# EAGLE design l5973d_mod (EAGLE 6.4)
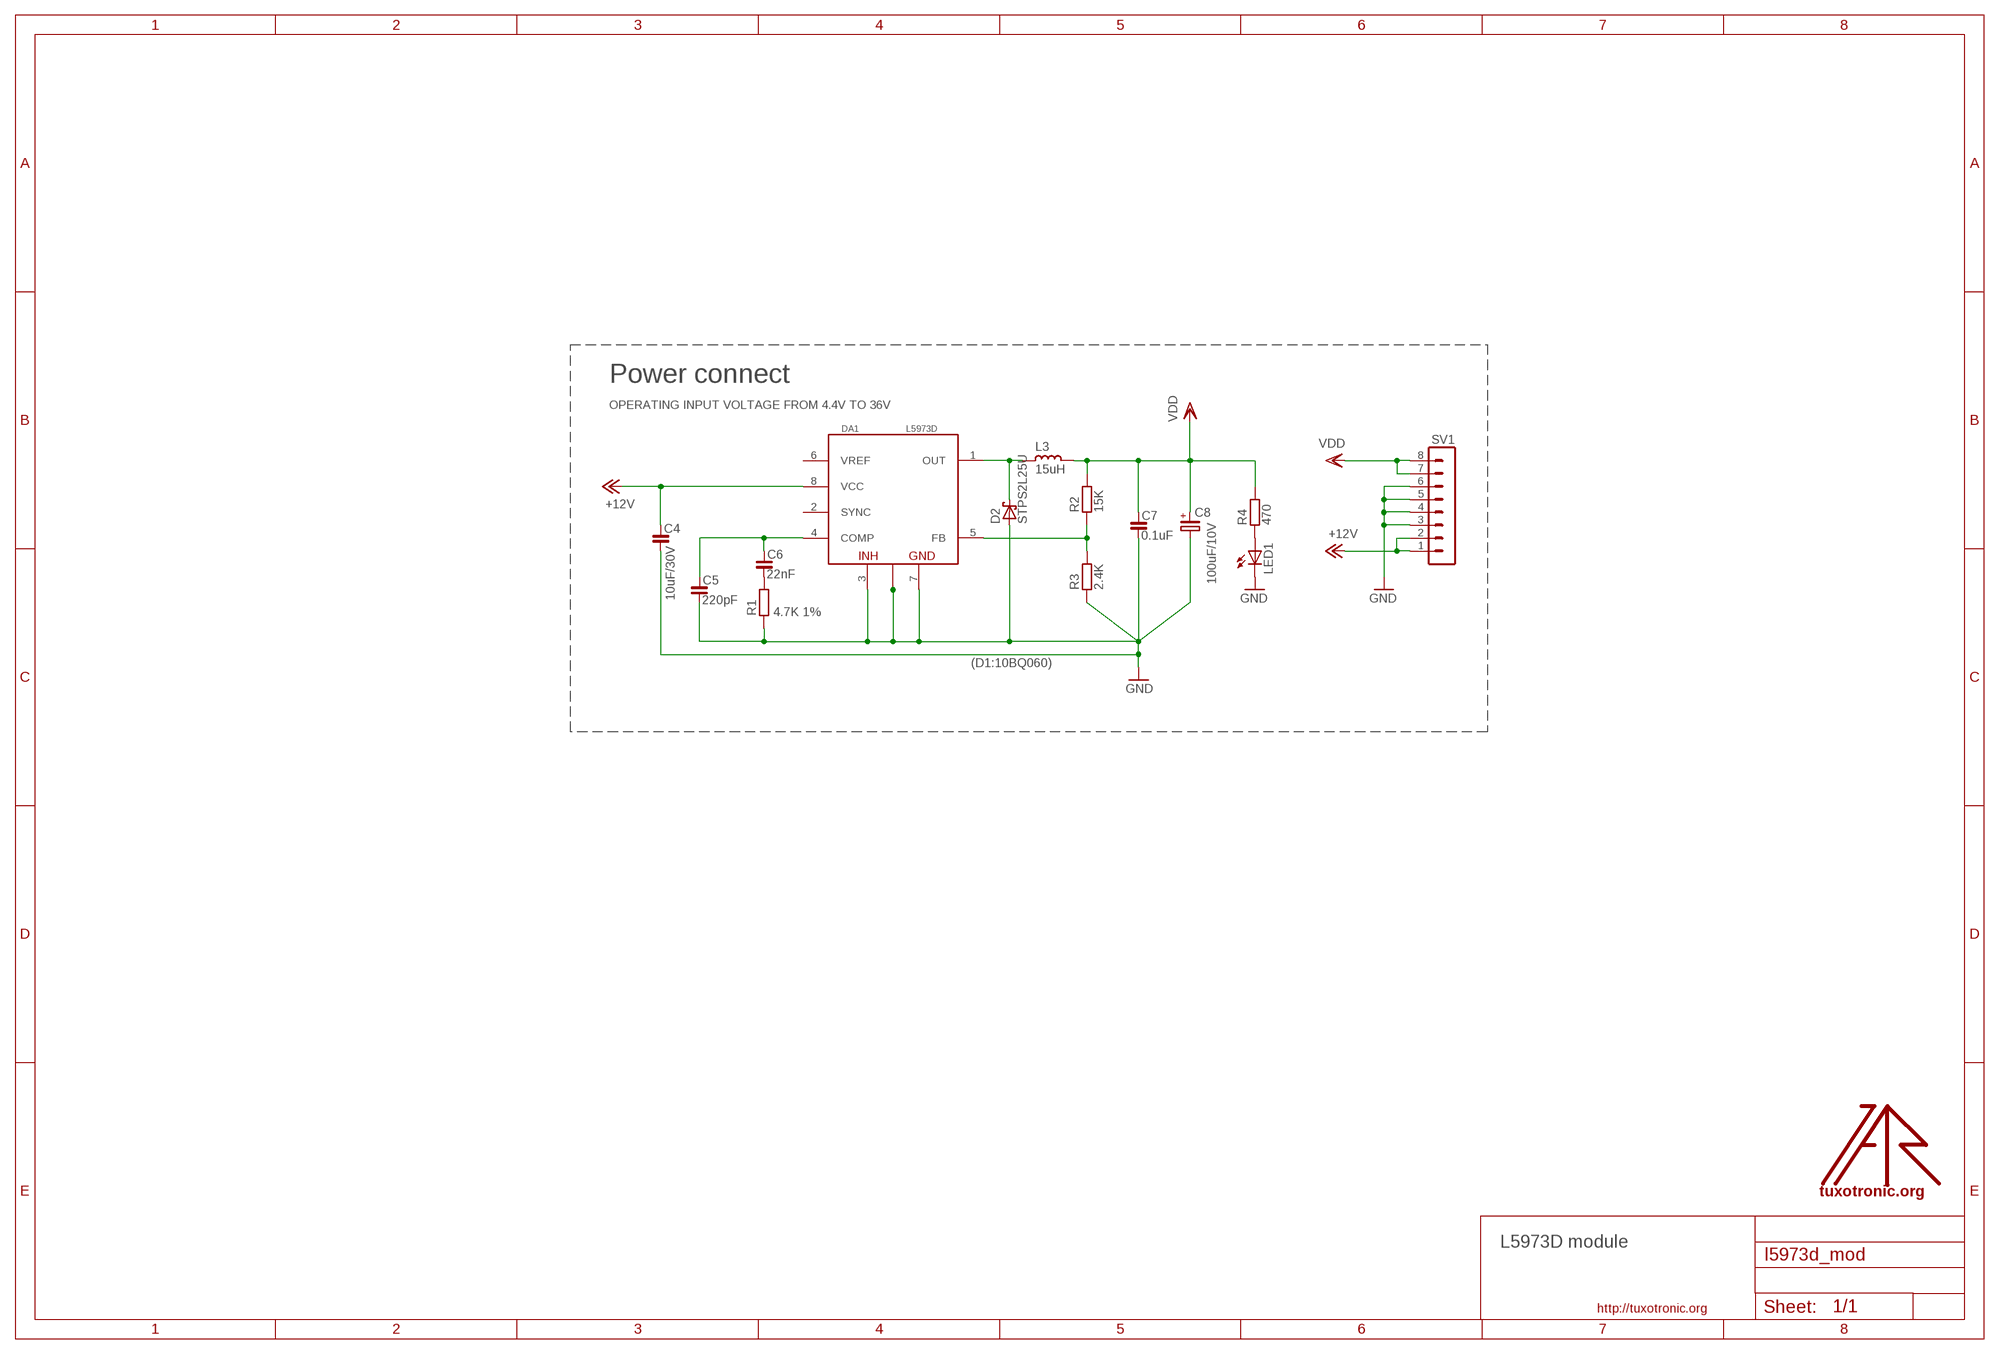
[diagram p0: schematic, sheet 1]

## Parts
C4  10uF/30V  C_1210  [C1210]
C5  220pF  C_0603  [C0603]
C6  22nF  C_0603  [C0603]
C7  0.1uF  C_0805  [C0805]
C8  100uF/10V  CP_E-035X080  [CE-035X080]
D2  STPS2L25U  SCHOTTKY-DIODESMD  [SMB]
DA1  L5973D  [HSOP8-PAD]
L3  15uH  L_CD75  [CD75]
LED1  LEDCHIPLED_0805  [CHIPLED_0805]
R1  4.7K 1%  R_0603  [R0603]
R2  15K  R_0603  [R0603]
R3  2.4K  R_0603  [R0603]
R4  470  R_0603  [R0603]
SV1  MA08-1W  [MA08-1W]
U$1  LOGO  [TT_LOGO]

## Nets
+12V: C4.1 DA1.8(VCC) SV1.1 SV1.2
GND: C4.2 C5.2 C7.2 C8.- D2.A DA1.3(INH) DA1.7(GND) DA1.P(GND) LED1.C R1.1 R3.1 SV1.3 SV1.4 SV1.5 SV1.6
N$29: LED1.A R4.1
N$41: D2.C DA1.1(OUT) L3.2
N$42: DA1.5(FB) R2.1 R3.2
N$43: C6.2 R1.2
N$44: C5.1 C6.1 DA1.4(COMP)
VDD: C7.1 C8.+ L3.1 R2.2 R4.2 SV1.7 SV1.8
Unconnected: DA1.2(SYNC) DA1.6(VREF)

## Notes on the sheet
- Power connect
- OPERATING INPUT VOLTAGE FROM 4.4V TO 36V
- (D1:10BQ060)
- L5973D module

## Library data of the parts
C4-C7 = rc-master-smd:C_: NON-POLARIZED CAP
C8 = rc-master:CP_: POLARIZED CAP
D2 = main:SCHOTTKY-DIODE: Schottky Diode
DA1 = vreg-pulse:L5973: 2A SWITCH STEP DOWN SWITCHING REGULATOR
L3 = rc-master-smd:L_: INDUCTOR
LED1 = led:LED: LED OSRAM: - CHIPLED LG R971, LG N971, LY N971, LG Q971, LY Q971, LO R971, LY R971 LH N974, LH R974 LS Q976, LO Q976, LY Q976 LO Q996 - Hyper CHIPLED LW Q18S LB Q993, LB Q99A, LB R99A - SideLED LS A670, LO A670, LY A670, LG A670, LP A670 LB A673, LV A673, LT A673, LW A673 LH A674 LY A675 LS A676, LA A676, LO A676, LY A676, LW A676 LS A679, LY A679, LG A679 - Hyper Micro SIDELED® LS Y876, LA Y876, LO Y876, LY Y876 LT Y87S - SmartLED LW L88C, LW L88S LB L89C, LB L89S, LG L890 LS L89K, LO L89K, LY L89K LS L896, LA L896, LO L896, LY L896 - TOPLED LS T670, LO T670, LY T670, LG T670, LP T670 LSG T670, LSP T670, LSY T670, LOP T670, LYG T670 LG T671, LOG T671, LSG T671 LB T673, LV T673, LT T673, LW T673 LH T674 LS T676, LA T676, LO T676, LY T676, LB T676, LH T676, LSB T676, LW T676 LB T67C, LV T67C, LT T67C, LS T67K, LO T67K, LY T67K, LW E67C LS E67B, LA E67B, LO E67B, LY E67B, LB E67C, LV E67C, LT E67C LW T67C LS T679, LY T679, LG T679 LS T770, LO T770, LY T770, LG T770, LP T770 LB T773, LV T773, LT T773, LW T773 LH T774 LS E675, LA E675, LY E675, LS T675 LS T776, LA T776, LO T776, LY T776, LB T776 LHGB T686 LT T68C, LB T68C - Hyper Mini TOPLED® LB M676 - Mini TOPLED Santana® LG M470 LS M47K, LO M47K, LY M47K Source: http://www.osram.convergy.de - LUMILED® LXK2-PW12-R00, LXK2-PW12-S00, LXK2-PW14-U00, LXK2-PW14-V00 LXK2-PM12-R00, LXK2-PM12-S00, LXK2-PM14-U00 LXK2-PE12-Q00, LXK2-PE12-R00, LXK2-PE12-S00, LXK2-PE14-T00, LXK2-PE14-U00 LXK2-PB12-K00, LXK2-PB12-L00, LXK2-PB12-M00, LXK2-PB14-N00, LXK2-PB14-P00, LXK2-PB14-Q00 LXK2-PR12-L00, LXK2-PR12-M00, LXK2-PR14-Q00, LXK2-PR14-R00 LXK2-PD12-Q00, LXK2-PD12-R00, LXK2-PD12-S00 LXK2-PH12-R00, LXK2-PH12-S00 LXK2-PL12-P00, LXK2-PL12-Q00, LXK2-PL12-R00 Source: www.luxeon.com
R1-R4 = rc-master-smd:R_: RESISTOR
SV1 = con-lstb:MA08-1W: PIN HEADER
U$1 = logo:LOGO

## Board
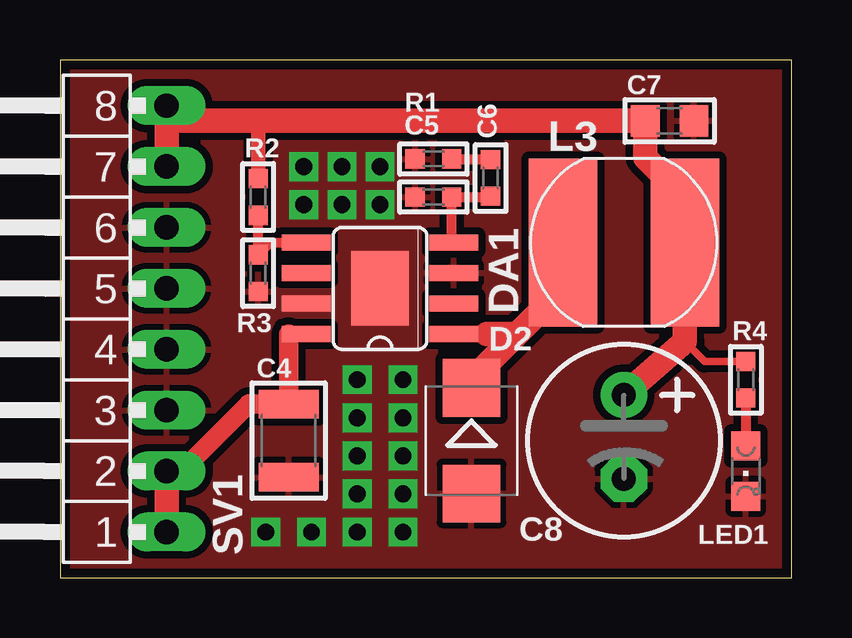
[diagram p1: board, top side]
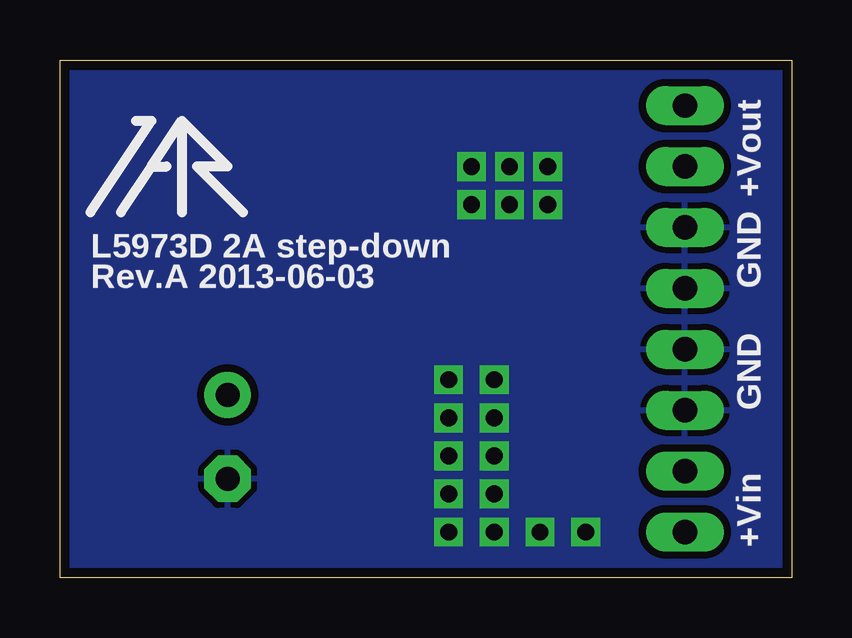
[diagram p2: board, bottom side, seen from below]

Size 30.48 x 21.59 mm. Coordinates in mm from the lower left corner, seen from the top.
Outline: 0,0 30.48,0 30.48,21.59 0,21.59 0,0
Copper layers (1*16): Top 0.018mm / dielectric 1.5011mm / Bottom 0.018mm
Design rules "resonit-speed-18mkm": minimum track width 0.16mm, minimum drill 0.5mm, track to track 0.16mm, track to pad 0.16mm, pad to pad 0.16mm, via to via 0.16mm, smd to smd 0.16mm, copper to edge 0.4mm, drill to drill 8mil, minimum pad ring 0.2489mm, minimum via ring 0.2489mm, stop-mask expansion 4mil, vias tented up to drill 0.5994mm, thermal gap 10mil

### Footprints (pad centres in the part's own frame; a part is rotated, then mirrored left to right if it is on the bottom)
C1210 = smd 1.2 x 2.5: 1 -1.524,0; 2 1.524,0
C0603 = smd 0.8 x 0.8: 1 -0.762,0; 2 0.762,0
C0805 = smd 1.2 x 1.3: 1 -1.016,0; 2 1.016,0
CE-035X080 = drill 1 pad 1.93: + -1.905,0 | drill 1 pad 1.93 octagon: - 1.587,0
SMB = smd 2.4 x 2.4: A 2.2,0; C -2.2,0
HSOP8-PAD = smd 0.66 x 2.032: 1 -1.905,-3.073; 2 -0.635,-3.073; 3 0.635,-3.073; 4 1.905,-3.073; 5 1.905,3.073; 6 0.635,3.073; 7 -0.635,3.073; 8 -1.905,3.073 | smd 3.1 x 2.41: P 0,0
CD75 = smd 7 x 2.85: 1 0,2.54; 2 0,-2.54
CHIPLED_0805 = smd 1.2 x 1.2: A 0,-1.05; C 0,1.05
R0603 = smd 0.8 x 0.8: 1 -0.762,0; 2 0.762,0
MA08-1W = drill 1.016 long: 1 -8.89,0; 2 -6.35,0; 3 -3.81,0; 4 -1.27,0; 5 1.27,0; 6 3.81,0; 7 6.35,0; 8 8.89,0

### Placement (x,y rotation side)
C4  9.53,5.71 270 top
C5  15.56,15.88 180 top
C6  17.94,16.67 90 top
C7  25.4,19.05 0 top
C8  23.5,5.71 270 top
D2  17.14,5.71 270 top
DA1  13.34,12.06 90 top
L3  23.5,13.97 270 top
LED1  28.57,4.45 180 top
R1  15.56,17.46 0 top
R2  8.26,15.88 90 top
R3  8.26,12.7 90 top
R4  28.57,8.26 90 top
SV1  4.45,10.79 90 top
U$1  25.4,17.78 0 bottom

### Tracks (layer width: path | path; a pad name or v marks a point on that pad's centre or on a via)
+12V
  Top 0.406: DA1.8 9.53,10.16
  Top 0.813: 9.53,10.16 C4.1 7.87,7.24 5.08,4.45 SV1.2
  Top 1.016: SV1.1 SV1.2
GND  (via drill 0.7)
  other vias: 12.38,8.26 14.29,8.26 14.29,6.67 14.29,5.08 12.38,6.67 12.38,5.08 13.34,15.56 11.75,15.56 11.75,17.14 13.34,17.14 10.16,15.56 10.16,17.14 12.38,3.49 14.29,3.49 12.38,1.91 14.29,1.91 10.48,1.91 8.57,1.91
  pour Top (isolate 0.305, rank 5): -0.64,22.23 31.11,22.23 31.11,-0.64 -0.64,-0.64
  pour Bottom (isolate 0.305, rank 5): -1.27,22.86 31.75,22.86 31.75,-1.27 -1.27,-1.27
N$29
  Top 0.406: R4.1 LED1.A
N$41
  Top 0.61: DA1.1 17.78,10.16
  Top 1.016: 17.78,10.16 19.05,10.16 | 19.05,10.16 20.95,12.06 L3.2 | D2.C 17.14,8.26 19.05,10.16
N$42
  Top 0.406: R2.1 R3.2 8.76,13.97 DA1.5
N$43
  Top 0.406: R1.2 17.91,17.46 C6.2
N$44
  Top 0.406: DA1.4 16.32,14.04 C5.1 17.97,15.88 C6.1
VDD
  Top 0.305: R4.2 26.86,9.02 26.04,9.84
  Top 0.61: 8.26,19.05 R2.2
  Top 1.016: C8.+ 26.04,9.84 L3.1 26.04,15.88 24.38,17.53 C7.1 8.26,19.05 5.08,19.05 SV1.8 SV1.7

### Text on the board
bPlace: +Vout | L5973D 2A step-down | GND | Rev.A 2013-06-03 | GND | +Vin